# Altium schematic sheet HomeLedEncoder.SchDoc: HomeLedEncoder
size Letter; ApprovedBy: Kevin Cotton; Author: Jessica Di Stefano; Revision: A; SheetNumber: 2; SheetTotal: 7
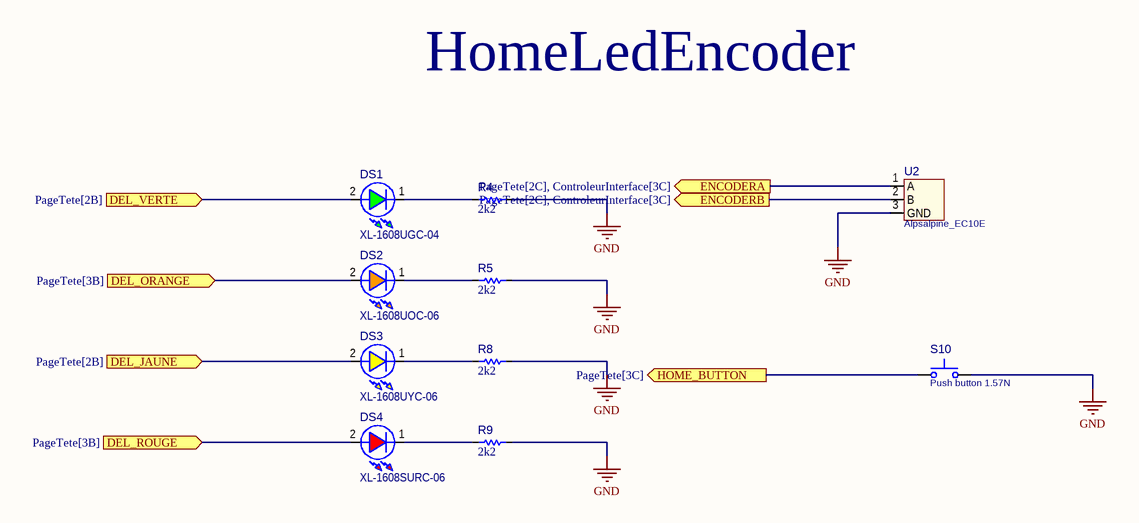
[diagram p0: HomeLedEncoder.SchDoc]

## Parts
DS1  XL-1608UGC-04  [D_LED_0603]
DS2  XL-1608UOC-06  [D_LED_0603]
DS3  XL-1608UYC-06  [D_LED_0603]
DS4  XL-1608SURC-06  [D_LED_0603]
R4  value 2k2  [R_1005[0402]]  (hidden comment: Res 2k2 1% 0402)
R5  value 2k2  [R_1005[0402]]  (hidden comment: Res 2k2 1% 0402)
R8  value 2k2  [R_1005[0402]]  (hidden comment: Res 2k2 1% 0402)
R9  value 2k2  [R_1005[0402]]  (hidden comment: Res 2k2 1% 0402)
S10  value Push button 1.57N  [S_Alpsalpine_SKPM]  (hidden comment: SKPMAME010)
U2  value Alpsalpine_EC10E  [U_Alpsalpine_EC10E]  (hidden comment: EC10E1220503)

## Ports
DEL_JAUNE (in, see PageTete[2B]), DEL_ORANGE (in, see PageTete[3B]), DEL_ROUGE (in, see PageTete[3B]), DEL_VERTE (in, see PageTete[2B]), ENCODERA (out, see PageTete[2C], ControleurInterface[3C]), ENCODERB (out, see PageTete[2C], ControleurInterface[3C]), HOME_BUTTON (out, see PageTete[3C])

## Nets
GND: R4.2 R5.2 R8.2 R9.2 S10.2 U2.3(GND)
DEL_JAUNE: DS3.2(A) ; port DEL_JAUNE
DEL_ORANGE: DS2.2(A) ; port DEL_ORANGE
DEL_ROUGE: DS4.2(A) ; port DEL_ROUGE
DEL_VERTE: DS1.2(A) ; port DEL_VERTE
ENCODERA: U2.1(A) ; port ENCODERA
ENCODERB: U2.2(B) ; port ENCODERB
HOME_BUTTON: S10.1 ; port HOME_BUTTON
NetDS1_1: DS1.1(K) R4.1
NetDS2_1: DS2.1(K) R5.1
NetDS3_1: DS3.1(K) R8.1
NetDS4_1: DS4.1(K) R9.1

## Notes on the sheet
- HomeLedEncoder
- Titre :
- Conception :
- Date :
- Approbation :
- Heure :
- Révision :
- Feuille
- de
- Fichier :

## Library data of the parts
DS1 = D_LED_GREEN_0603: LED Green Clear 40mcd 140deg; Manufacturer 1: XINGLIGHT; CEGEP: KLEDVC0603; Value: Green; Manufacturer 2: Wurth; Manufacturer Part Number 1: XL-1608UGC-04; Manufacturer Part Number 2: 150060VS75000; Mounting Technology: SMT; Supplier 1: LCSC; Supplier 2: Digikey; Supplier Part Number 1: C965804; Supplier Part Number 2: 732-4980-1-ND
DS2 = D_LED_ORANGE_0603: LED Orange Clear; Manufacturer 1: XINGLIGHT; CEGEP: KLEDOC0603; Value: Orange; Manufacturer 2: Wurth; Manufacturer Part Number 1: XL-1608UOC-06; Manufacturer Part Number 2: 150060AS75000; Mounting Technology: SMT; Supplier 1: LCSC; Supplier 2: Digikey; Supplier Part Number 1: C965800; Supplier Part Number 2: 732-150060AS75000CT-ND
DS3 = D_LED_YELLOW_0603: LED Yellow Clear; Manufacturer 1: XINGLIGHT; CEGEP: KLEDJC0603; Value: Yellow; Manufacturer 2: Wurth; Manufacturer Part Number 1: XL-1608UYC-06; Manufacturer Part Number 2: 150060YS75000; Mounting Technology: SMT; Supplier 1: LCSC; Supplier 2: Digikey; Supplier Part Number 1: C965802; Supplier Part Number 2: 732-4981-1-ND
DS4 = D_LED_RED_0603: LED Red Clear 60mcd 140deg; Manufacturer 1: XINGLIGHT; CEGEP: KLEDRC0603; Value: Red; Manufacturer 2: Wurth; Manufacturer Part Number 1: XL-1608SURC-06; Manufacturer Part Number 2: 150060SS75000; Mounting Technology: SMT; Supplier 1: LCSC; Supplier 2: Digikey; Supplier Part Number 1: C965799; Supplier Part Number 2: 732-4979-1-ND
R4 R5 R8 R9 = RES008: Resistor type 1; Manufacturer 1: Yageo; Manufacturer Part Number 1: RC0402FR-072K2L; Puissance: 1/16W; Max Working Voltage: 50V; LibRef: RES008; Tolerance: 1%; Mount: SMT; Supplier 1: LCSC; Supplier Part Number 1: C114762; Supplier 2: Digi-Key; Supplier Part Number 2: 311-2.20KLRCT-ND
S10 = SW_Push_SKPM_157N: Push button 1.57N; Manufacturer 1: ALPSALPINE; Manufacturer Part Number 1: SKPMAME010; Mounting Technology: SMT; Supplier 1: LCSC; Supplier 2: DigiKey; Supplier Part Number 1: C115348; Supplier Part Number 2: 4809-SKPMAME010CT-ND
U2 = U_Alpsalpine_EC10E: Rotary Encoder TH; Manufacturer 1: ALPSALPINE; Manufacturer Part Number 1: EC10E1220503; Mounting Technology: TH; Supplier 1: LCSC; Supplier 2: DigiKey; Supplier Part Number 1: C110291; Supplier Part Number 2: 4809-EC10E1220503-ND